# Altium schematic sheet Power.SchDoc
size A4; SheetNumber: 3; SheetTotal: 5; SPICEModelCacheQNSYMEED: <root> / <DocumentId>QNSYMEED</DocumentId> / </root>
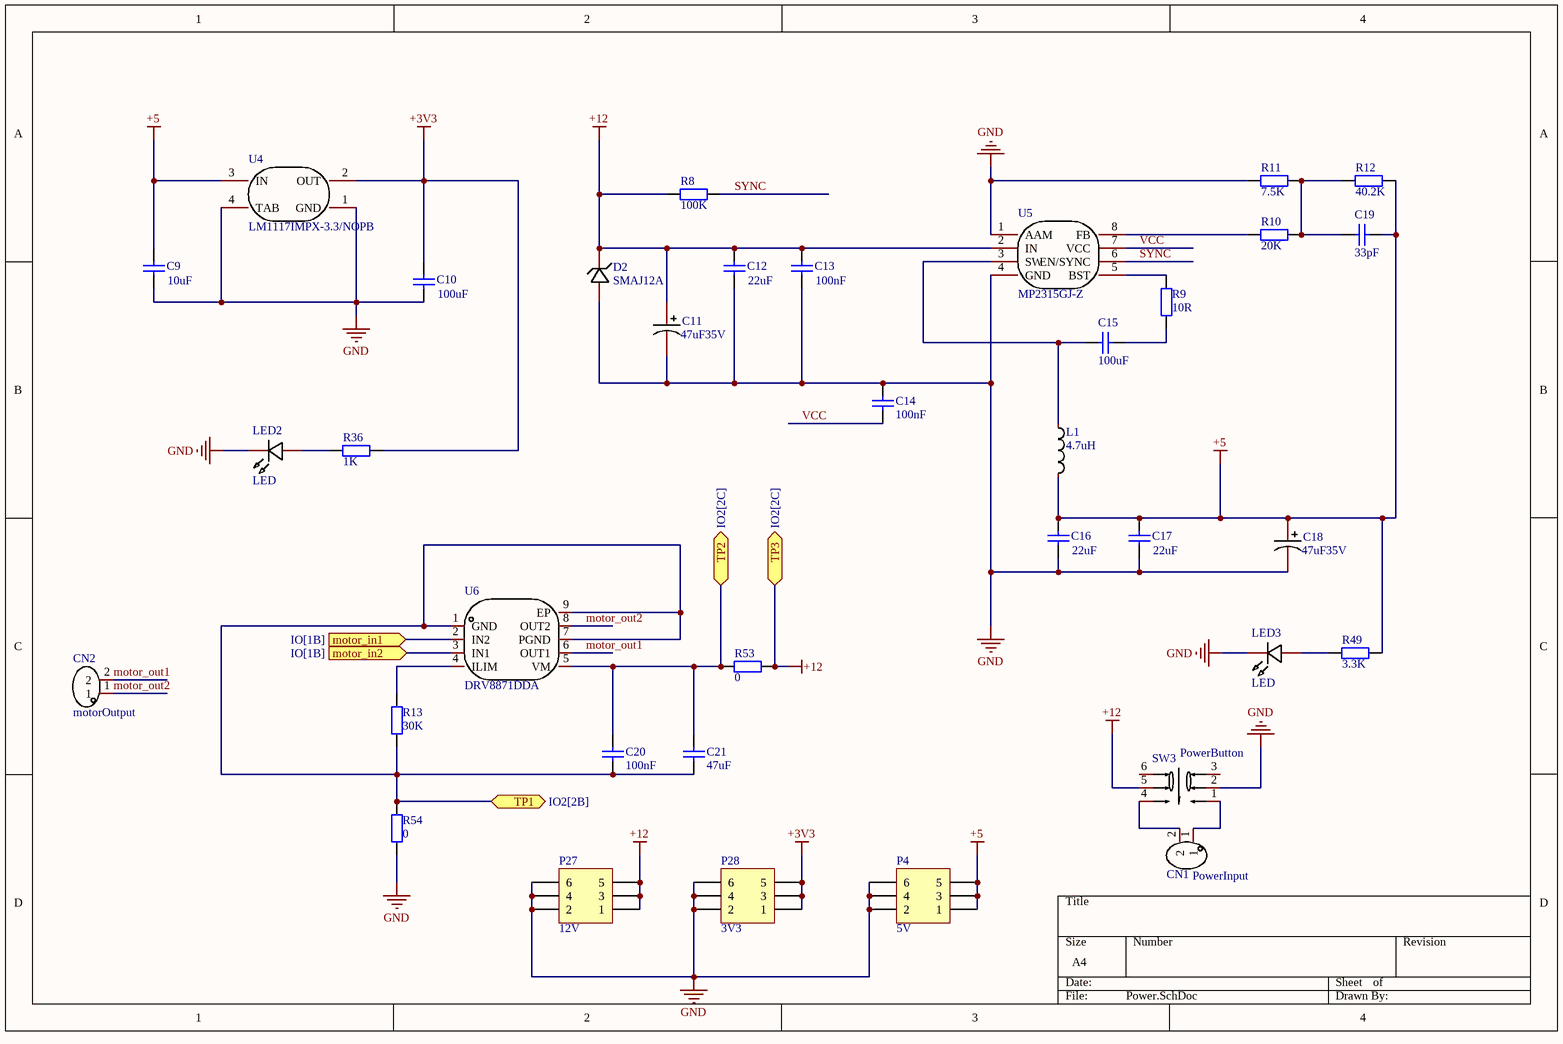
[diagram p0: Power.SchDoc]

## Parts
C9  value 10uF  [RAD-0.3]  (hidden comment: Cap)
C10  value 100uF  [RAD-0.3]  (hidden comment: Cap)
C11  Name: 47uF35V  [CAP-TH_BD5.0-P2.00-D0.5-FD-A]  (hidden comment: 47uF)
C12  value 22uF  [RAD-0.3]  (hidden comment: Cap)
C13  value 100nF  [RAD-0.3]  (hidden comment: Cap)
C14  value 100nF  [RAD-0.3]  (hidden comment: Cap)
C15  value 100uF  [RAD-0.3]  (hidden comment: Cap)
C16  value 22uF  [RAD-0.3]  (hidden comment: Cap)
C17  value 22uF  [RAD-0.3]  (hidden comment: Cap)
C18  Name: 47uF35V  [CAP-TH_BD5.0-P2.00-D0.5-FD-A]  (hidden comment: 47uF)
C19  value 33pF  [RAD-0.3]  (hidden comment: Cap)
C20  value 100nF  [RAD-0.3]  (hidden comment: Cap)
C21  value 47uF  [RAD-0.3]  (hidden comment: Cap)
CN1  MX126-5.0-02P-GN01-Cu-S-A: PowerInput  [CONN-TH_2P-P5.00_MX126-5.0-GN01-02P-CU-S-A]  (hidden comment: MX126-5.0-02P-GN01-Cu-S-A)
CN2  MX126-5.0-02P-GN01-Cu-S-A: motorOutput  [CONN-TH_2P-P5.00_MX126-5.0-GN01-02P-CU-S-A]  (hidden comment: MX126-5.0-02P-GN01-Cu-S-A)
D2  SMAJ12A  [SMA_L4.3-W2.6-LS5.2-RD]
L1  4.7uH  [IND-SMD_L5.4-W5.2_FXL0530]
LED2  Name: LED  [LED-TH_BD5.0-P2.54-FD]  (hidden comment: HL-503S45FC)
LED3  Name: LED  [LED-TH_BD5.0-P2.54-FD]  (hidden comment: HL-503S45FC)
P4  5V  [HDR2X3]
P27  12V  [HDR2X3]
P28  3V3  [HDR2X3]
R8  value 100K  [AXIAL-0.4]  (hidden comment: Res2)
R9  value 10R  [AXIAL-0.4]  (hidden comment: Res2)
R10  value 20K  [AXIAL-0.4]  (hidden comment: Res2)
R11  value 7.5K  [AXIAL-0.4]  (hidden comment: Res2)
R12  value 40.2K  [AXIAL-0.4]  (hidden comment: Res2)
R13  value 30K  [AXIAL-0.4]  (hidden comment: Res2)
R36  value 1K  [AXIAL-0.4]  (hidden comment: Res2)
R49  value 3.3K  [AXIAL-0.4]  (hidden comment: Res2)
R53  value 0  [AXIAL-0.4]  (hidden comment: Res2)
R54  value 0  [AXIAL-0.4]  (hidden comment: Res2)
SW3  XKB7070-Z: PowerButton  [SW-TH_6P-L7.0-W7.0-P2.00]  (hidden comment: XKB7070-Z)
U4  LM1117IMPX-3.3/NOPB  [SOT-223_L6.5-W3.5-P2.30-LS7.0-BR]
U5  MP2315GJ-Z  [TSOT-23-8_L2.9-W1.6-P0.65-LS2.8-BR]
U6  DRV8871DDA  [POWERPAD-SO-8_L4.9-W3.9-P1.27-LS6.0-BL-EP]

## Ports
motor_in1 (in, see IO[1B]), motor_in2 (in, see IO[1B]), TP1 (bidir, see IO2[2B]), TP2 (bidir, see IO2[2C]), TP3 (bidir, see IO2[2C])

## Nets
+3V3: C10.2 P28.1 P28.3 P28.5 R36.1 U4.2(OUT)
+5: C9.2 C16.2 C17.2 C18.1 C19.2 L1.2 P4.1 P4.3 P4.5 R12.2 R49.1 U4.3(IN)
+12: C11.1 C12.2 C13.2 D2.1(C) P27.1 P27.3 P27.5 R8.2 R53.2 SW3.5 U5.2(IN) ; port TP3
GND: C9.1 C10.1 C11.2 C12.1 C13.1 C14.1 C16.1 C17.1 C18.2 D2.2(A) LED2.2 LED3.2 P4.2 P4.4 P4.6 P27.2 P27.4 P27.6 P28.2 P28.4 P28.6 R11.1 R54.1 SW3.2 U4.1(GND) U4.4(TAB) U5.1(AAM) U5.4(GND)
motor_in1: U6.2(IN2) ; port motor_in1
motor_in2: U6.3(IN1) ; port motor_in2
motor_out1: CN2.2 U6.6(OUT1)
motor_out2: CN2.1 U6.8(OUT2)
SYNC: R8.1 U5.6(EN/SYNC)
TP1: C20.2 C21.2 R13.2 R54.2 U6.1(GND) U6.7(PGND) U6.9(EP) ; port TP1
TP2: C20.1 C21.1 R53.1 U6.5(VM) ; port TP2
VCC: C14.2 U5.7(VCC)
NetC15_1: C15.1 L1.1 U5.3(SW)
NetC15_2: C15.2 R9.2
NetC19_1: C19.1 R10.2 R11.2 R12.1
NetCN1_1: CN1.1 SW3.1
NetCN1_2: CN1.2 SW3.4
NetLED2_1: LED2.1 R36.2
NetLED3_1: LED3.1 R49.2
NetR9_1: R9.1 U5.5(BST)
NetR10_1: R10.1 U5.8(FB)
NetR13_1: R13.1 U6.4(ILIM)

Not connected (* = marked no-connect by the designer): SW3 3 6

## Library data of the parts
C9 C10 C12-C17 C19-C21 = Cap: Capacitor; Published: 8-Jun-2000; LatestRevisionDate: 17-Jul-2002; LatestRevisionNote: Re-released for DXP Platform.; PackageReference: RAD-0.3; Publisher: Altium Limited; PackageDescription: Radial Cap, Thru-Hole; 2 Leads; 0.3 in Pin Spacing
C11 C18 = 01EC1119: Manufacturer: KNSCHA(科尼盛); Add into BOM: yes; Tolerance: ±20%; Rated Voltage: 35V; Ripple Current: 135mA@100kHz; Equivalent Series Resistance(ESR): 1Ω@100kHz; φD: 5mm; L: 11mm; Lifetime @ Temp: 7000hrs@105℃; Symbol: 01EC1119; Device: 01EC1119; LCSC Part Name: 47uF ±20% 35V; Supplier Part: C2833295; Manufacturer Part: 01EC1119; Supplier Footprint: 插件,D5xL11mm; JLCPCB Part Class: 扩展库; Datasheet: https://atta.szlcsc.com/upload/public/pdf/source/20210521/C2833295_D5EF56CA4AAF67B2F3976F630DF1C3A7.pdf; Supplier: LCSC; Convert to PCB: yes; Value: 47uF; Lead Spacing: 2mm; Operating Temperature: -55℃~+105℃
CN1 CN2 = MX126-5.0-02P-GN01-Cu-S-A: Manufacturer: MAX(迈旭); Symbol: MX126-5.0-GN01-02P-CU-S-A; Add into BOM: yes; Structure: 1x2P; Pitch: 5mm; Current Rating (Max): 10A; Voltage Rating (Max): 300V; Wire Gauge - AWG: 14~26; Wire Gauge - mm2: 2.5; Number of PINs Per Row: 2; Device: MX126-5.0-02P-GN01-Cu-S-A; LCSC Part Name: 5mm 1x2P 排数:1 每排P数:2 直插; Supplier Part: C5188434; Manufacturer Part: MX126-5.0-02P-GN01-Cu-S-A; Supplier Footprint: 插件,P=5mm; JLCPCB Part Class: 扩展库; Datasheet: https://atta.szlcsc.com/upload/public/pdf/source/20230914/2B012B5258BE925E2417FA81B30CB923.pdf; Supplier: LCSC; Convert to PCB: yes; Color: 绿色; Mounting Style: 直插; Number of Pins: 2P; Number of Rows: 1; Contact Material: 铜合金; Contact Plating: 锡; Operating Temperature Range: -40℃~+105℃
D2 = SMAJ12A_C148213: Manufacturer: Littelfuse(美国力特); Symbol: SMAJ12A-C148213; Add into BOM: yes; polarity: 单向; Reverse Stand-Off Voltage (Vrwm): 12V; Maximum Clamping Voltage: 19.9V; Peak Pulse Current (Ipp)@10/1000us: 20.1A; Peak Pulse Power Dissipation (Ppp)@10/1000us: 400W; Breakdown Voltage: 13.3V; Type: TVS; Device: SMAJ12A_C148213; LCSC Part Name: 单向TVS 12V截止; Supplier Part: C148213; Manufacturer Part: SMAJ12A; Supplier Footprint: SMA(DO-214AC); JLCPCB Part Class: 扩展库; Datasheet: https://atta.szlcsc.com/upload/public/pdf/source/20190402/C374025_5ACE77BC72947DF13CF0CBC7F8B57228.pdf; Supplier: LCSC; Convert to PCB: yes; Name: SMAJ12A
L1 = FXL0530-4R7-M: Manufacturer: cjiang(长江微电); Add into BOM: yes; Tolerance: ±20%; Rated Current: 4.5A; Saturation Current (Isat): 5A; DC Resistance (DCR): 60mΩ; Type: 一体成型电感; Symbol: FXL0530-4R7-M; Device: FXL0530-4R7-M; LCSC Part Name: 4.7uH ±20% 5A; Supplier Part: C177246; Manufacturer Part: FXL0530-4R7-M; Supplier Footprint: SMD,5.2x5.4mm; JLCPCB Part Class: 扩展库; Datasheet: https://atta.szlcsc.com/upload/public/pdf/source/20240426/3189EA8206330E2108542F9E34E540E7.pdf; Supplier: LCSC; Convert to PCB: yes; Value: 4.7uH; 4R7: 4.7uH
LED2 LED3 = HL-503S45FC: Manufacturer: HONGLITRONIC(鸿利光电); Add into BOM: yes; Lamp Holder Type: 5mm圆形灯头; Emitted Color: 红色; Forward Voltage (VF): 2.2V; Power Dissipation: 66mW; Forward Current: 20mA; Dominant Wavelength: 617nm~627nm; Lens Color: 无色透明透镜; Luminous Intensity: 10750mcd; Viewing Angle: 15°; Symbol: HL-503S45FC; Device: HL-503S45FC; Supplier: LCSC; Supplier Part: C568942; Manufacturer Part: HL-503S45FC; JLCPCB Part Class: 扩展库; LCSC Part Name: HL-503S45FC; Supplier Footprint: 插件,D=5mm; Datasheet: https://atta.szlcsc.com/upload/public/pdf/source/20200630/C568942_DE1B88CAD7C81208DB145E6C2FD02F7C.pdf; Convert to PCB: yes; Peak Wavelength: -; Diode Configuration: -; Color Temperature: -; Mounting Sytle: -; Operating Temperature: -30℃~+80℃
P4 P27 P28 = Header 3X2: Header, 3-Pin, Dual row; LatestRevisionDate: 17-Jul-2002; LatestRevisionNote: Re-released for DXP Platform.; Publisher: Altium Limited
R8-R13 R36 R49 R53 R54 = Res2: Resistor; Published: 8-Jun-2000; LatestRevisionDate: 17-Jul-2002; LatestRevisionNote: Re-released for DXP Platform.; PackageReference: AXIAL-0.4; Publisher: Altium Limited; PackageDescription: Axial Device, Thru-Hole; 2 Leads; 0.4 in Pin Spacing
SW3 = XKB7070-Z: Manufacturer: XKB Connectivity(中国星坤); Add into BOM: yes; Self Lock / No Lock: 自锁; Actuator Style: 矩形按钮; Contact Current: 100mA; Voltage Rating (AC): 250V; Voltage Rating (DC): 30V; Insulation Resistance: 100MΩ; Actuator/Cap Color: 蓝色; With Lamp: 不带; Pin Style: PC引脚; Operating Force: 160gf; Mechanical Life: 10万次; Symbol: XKB7070-Z; Device: XKB7070-Z; Supplier: LCSC; Supplier Part: C318863; Manufacturer Part: XKB7070-Z; JLCPCB Part Class: 扩展库; LCSC Part Name: 按键开关   7*7插件自锁 蓝白黑; Supplier Footprint: 插件; Datasheet: https://atta.szlcsc.com/upload/public/pdf/source/20211015/75A682A27A424BDE8D93C2CFA14C38FE.pdf; Convert to PCB: yes; IP Rating: -; Mounting Style: 直插; Operating Temperature: -15℃~+55℃
U4 = LM1117IMPX-3.3/NOPB: Manufacturer: TI(德州仪器); Add into BOM: yes; Output Type: 固定; Maximum Input Voltage: 15V; Output Voltage: 3.3V; MAX Output Current: 800mA; Power Supply Rejection Ratio (PSRR): 75dB@(120Hz); Dropout Voltage: 1.2V@(800mA); standby current: 5mA; Output Polarity: 正极; Number of Outputs: 1; Symbol: LM1117IMPX-3.3/NOPB; Device: LM1117IMPX-3.3/NOPB; LCSC Part Name: 输入20V 输出3.3V 800mA; Supplier Part: C23984; Manufacturer Part: LM1117IMPX-3.3/NOPB; Supplier Footprint: SOT-223; JLCPCB Part Class: 扩展库; Datasheet: http://www.ti.com/cn/lit/gpn/lm1117; Supplier: LCSC; Convert to PCB: yes; Operating Temperature: -40℃~+125℃; Name: LM1117IMPX-3.3/NOPB
U5 = MP2315GJ-Z: Manufacturer: MPS(芯源); Add into BOM: yes; Function: 降压型; Output Type: 可调; Input Voltage: 4.5V~24V; Output Voltage: 800mV~22.8V; Output Current (Max): 3A; Switching Frequency: 500kHz; Synchronous Rectification: 是; Number of Outputs: 1; Topology: 降压式; Switch tube (built-in/external): 内置; Symbol: MP2315GJ-Z; Device: MP2315GJ-Z; LCSC Part Name: MP2315GJ-Z; Supplier Part: C45889; Manufacturer Part: MP2315GJ-Z; Supplier Footprint: TSOT-23-8; JLCPCB Part Class: 扩展库; Datasheet: https://atta.szlcsc.com/upload/public/pdf/source/20240315/E986BDF075E08D3649664A84BD5F173B.pdf; Supplier: LCSC; Convert to PCB: yes; Operating Temperature: -40℃~+125℃@(TJ); Name: MP2315GJ-Z
U6 = DRV8871DDA: Manufacturer: TI(德州仪器); Add into BOM: yes; Symbol: DRV8871DDA; Device: DRV8871DDA; LCSC Part Name: DRV8871DDA; Supplier Part: C1556867; Manufacturer Part: DRV8871DDA; Supplier Footprint: SO-8-EP; JLCPCB Part Class: 扩展库; Datasheet: https://www.ti.com/cn/lit/gpn/drv8871; Supplier: LCSC; Convert to PCB: yes; Name: DRV8871DDA